# Altium schematic sheet 03_ EFR32 Signal Assignments.SchDoc: EFR32FG28 Diversity Board with discrete matching network for 868/915 MHz
size 420 x 297 mm; Doc: BRD4210C; OrgName: Silicon Labs; Page Number: 3; Page Title: EFR32 Signal Assignments; Page Size: A3; Page Count: 4; Board Designer: MSZ; RevCode: A00; DsnPath: C:\Users\maszvobo\Downloads\BRD4210A-A01-schematic-dsn\BRD4210A.DSN; SchematicName: SCHEMATIC1; PageName: 03: EFR32 Signal Assignments; PageSize: A3; TopSchematic: True
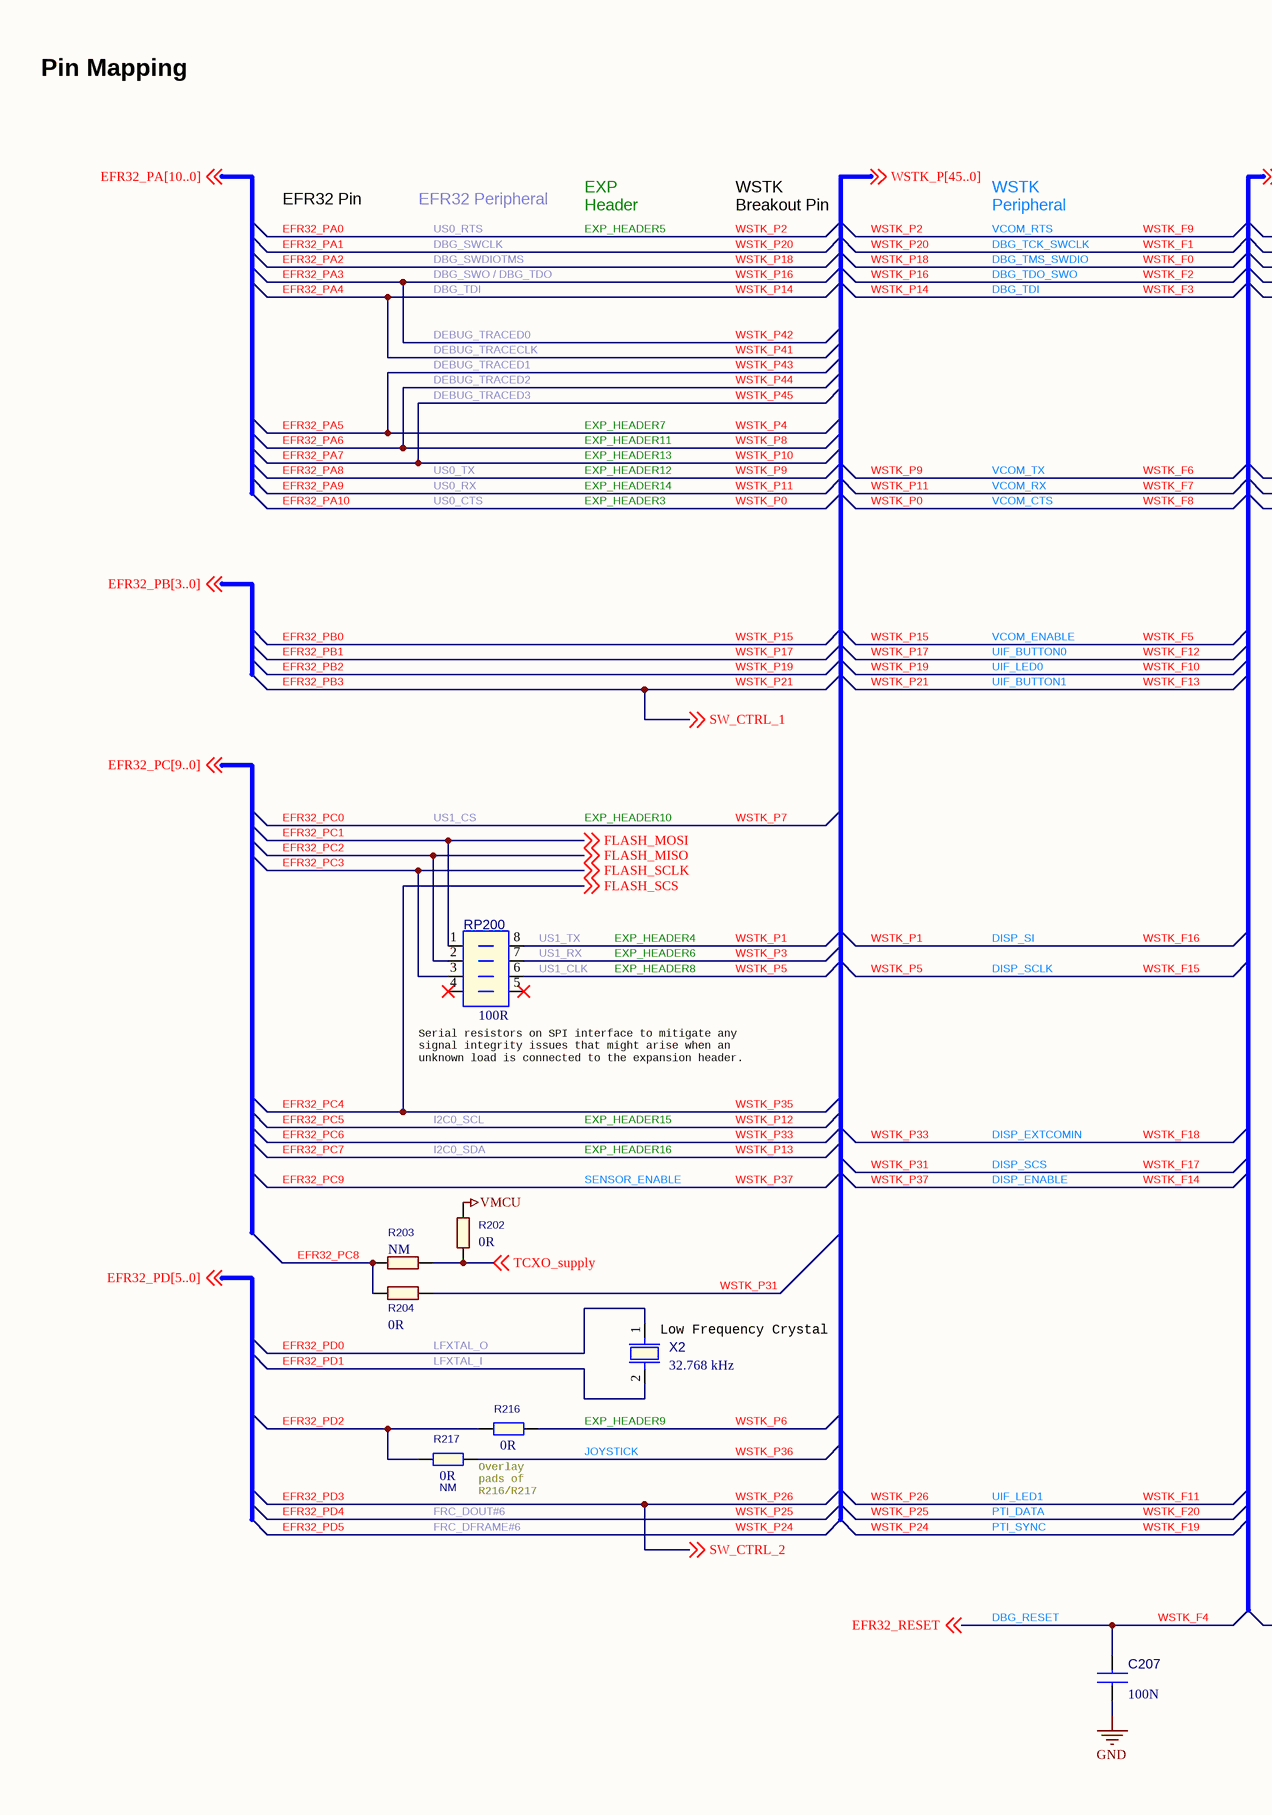
[diagram p0: 03_ EFR32 Signal Assignments.SchDoc, left]
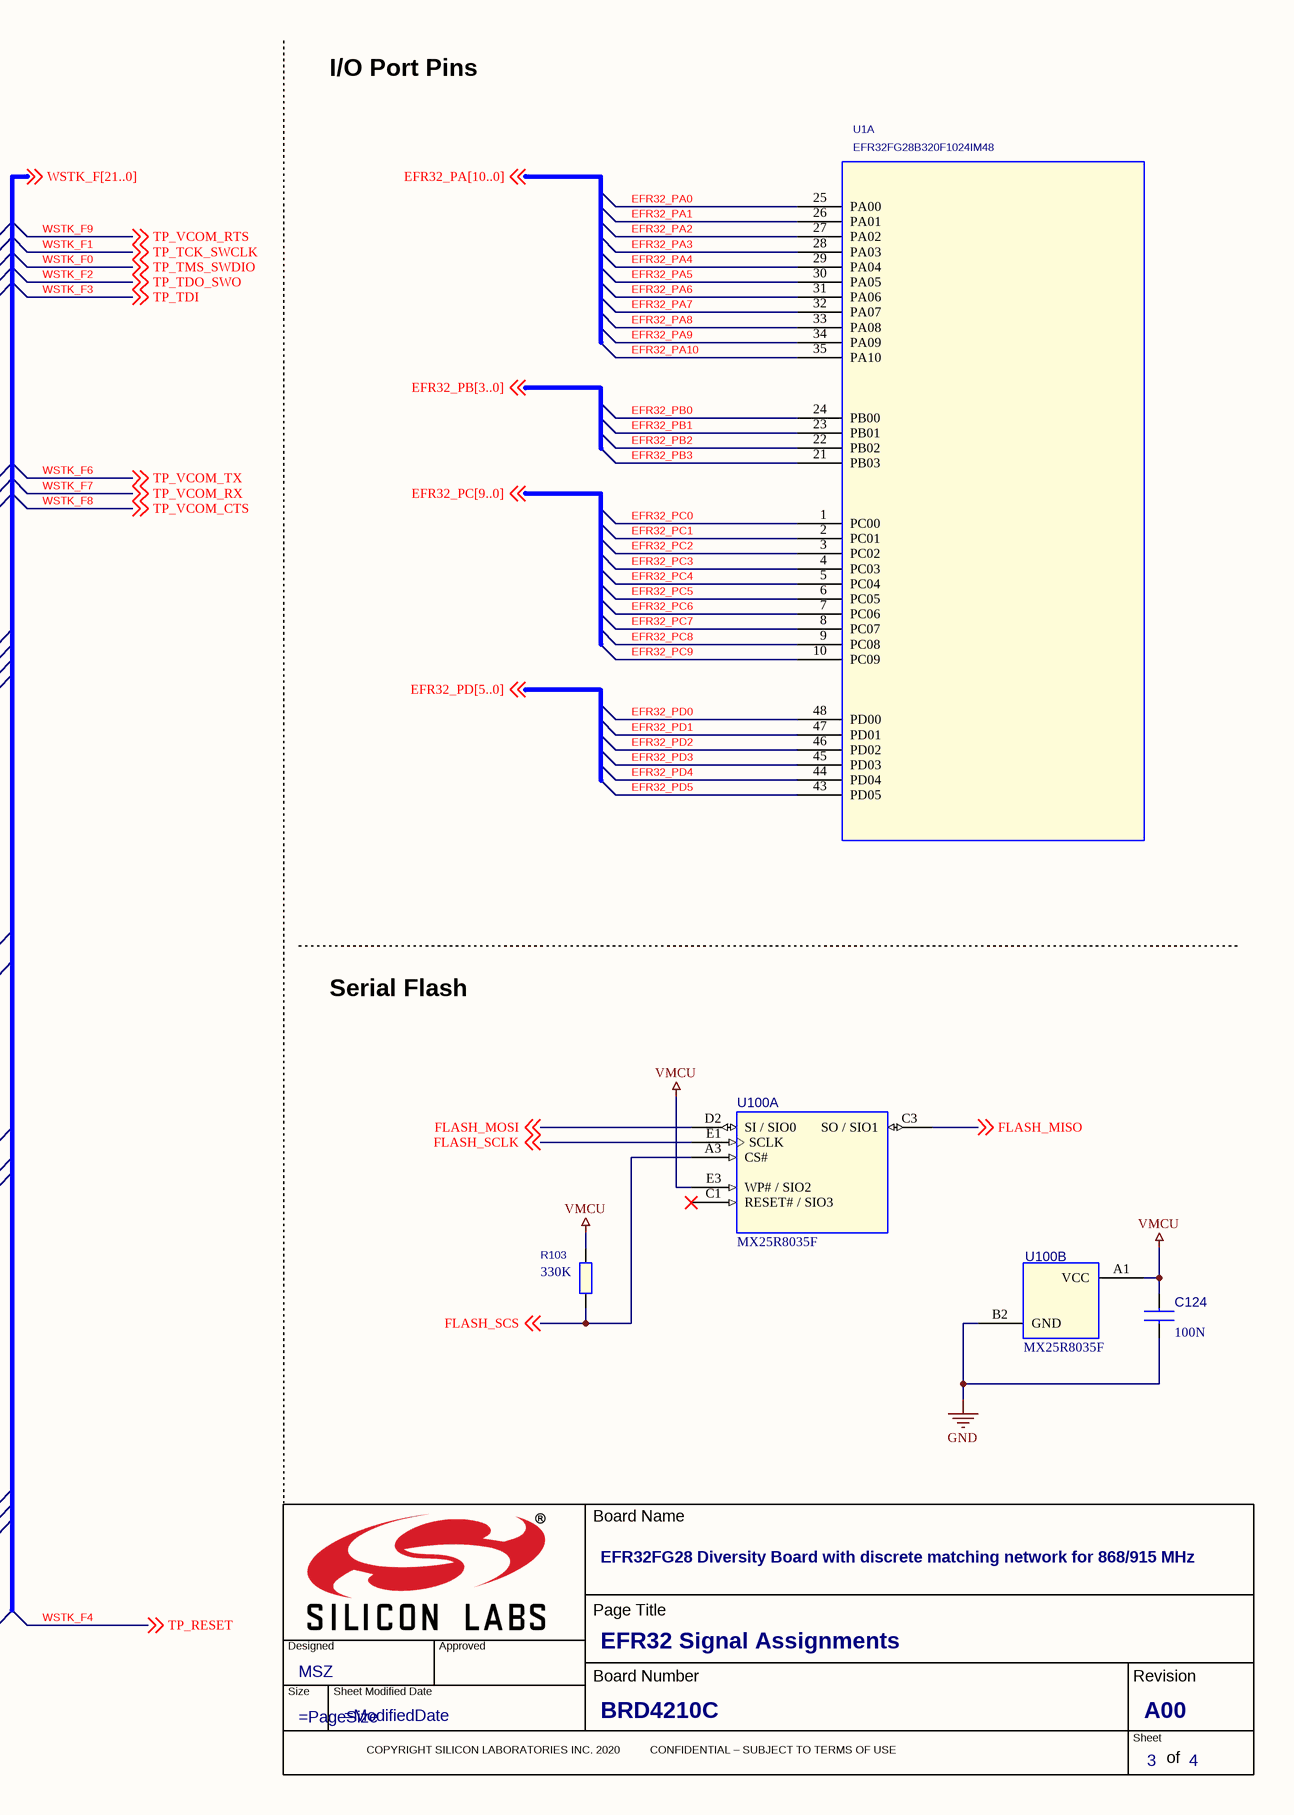
[diagram p1: 03_ EFR32 Signal Assignments.SchDoc, right]

## Parts
*  Doc: BRD4210C  RevCode: A00  Board Designer: MSZ  Page Title: EFR32 Signal Assignments  Page Number: 3  Page Count: 4  Title: EFR32FG28 Diversity Board with discrete matching network for 868/915 MHz  (graphical)
C124  100N  [C0201_L]
C207  100N  [C0201_L]
R103  330K  [R0201_L]
R202  0R  [R0201_L]
R203  NM  [R0201_L]
R204  0R  [R0201_L]
R216  0R  [R0402_L]
R217  0R  Not Mounted: NM  [R0402_L]
RP200  100R  [RES_MNR04-8]
U1  EFR32FG28B320F1024IM48  [QFN48_M040_6.0X6.0_EP_SL]  (part A of 3)
U100  MX25R8035F  [BGA8_M040_1.24x1.75_WLCSP]  (parts A,B of 2)
X2  32.768 kHz  [X_MCS_CM8V-T1A]

## Nets
GND: C124.2 C207.2 U100.B2(GND)
VMCU: C124.1 R103.2 R202.2 U100.A1(VCC) U100.E3(WP#_/_SIO2)
DBG_RESET: C207.1 ; off-sheet EFR32_RESET, off-sheet TP_RESET  [also labelled EFR32_RESET, TP_RESET, WSTK_F4]
DBG_SWCLK: U1.26(PA01) ; off-sheet TP_TCK_SWCLK  [also labelled DBG_TCK_SWCLK, EFR32_PA1, TP_TCK_SWCLK, WSTK_F1, WSTK_P20]
DBG_SWDIOTMS: U1.27(PA02) ; off-sheet TP_TMS_SWDIO  [also labelled DBG_TMS_SWDIO, EFR32_PA2, TP_TMS_SWDIO, WSTK_F0, WSTK_P18]
DBG_SWO / DBG_TDO: U1.28(PA03) ; off-sheet TP_TDO_SWO  [also labelled DBG_TDO_SWO, DEBUG_TRACED0, EFR32_PA3, TP_TDO_SWO, WSTK_F2, WSTK_P16, WSTK_P42]
DBG_TDI: U1.29(PA04) ; off-sheet TP_TDI  [also labelled DEBUG_TRACECLK, EFR32_PA4, TP_TDI, WSTK_F3, WSTK_P14, WSTK_P41]
DEBUG_TRACED1: U1.30(PA05)  [also labelled EFR32_PA5, EXP_HEADER7, WSTK_P4, WSTK_P43]
DEBUG_TRACED2: U1.31(PA06)  [also labelled EFR32_PA6, EXP_HEADER11, WSTK_P44, WSTK_P8]
DEBUG_TRACED3: U1.32(PA07)  [also labelled EFR32_PA7, EXP_HEADER13, WSTK_P10, WSTK_P45]
DISP_ENABLE: U1.10(PC09)  [also labelled EFR32_PC9, SENSOR_ENABLE, WSTK_F14, WSTK_P37]
DISP_EXTCOMIN: U1.7(PC06)  [also labelled EFR32_PC6, WSTK_F18, WSTK_P33]
DISP_SCLK: RP200.6(R16)  [also labelled EXP_HEADER8, US1_CLK, WSTK_F15, WSTK_P5]
DISP_SCS: R204.1  [also labelled WSTK_F17, WSTK_P31]
DISP_SI: RP200.8(R18)  [also labelled EXP_HEADER4, US1_TX, WSTK_F16, WSTK_P1]
EFR32_PA0: U1.25(PA00) ; off-sheet TP_VCOM_RTS  [also labelled EXP_HEADER5, TP_VCOM_RTS, US0_RTS, VCOM_RTS, WSTK_F9, WSTK_P2]
EFR32_PA8: U1.33(PA08) ; off-sheet TP_VCOM_TX  [also labelled EXP_HEADER12, TP_VCOM_TX, US0_TX, VCOM_TX, WSTK_F6, WSTK_P9]
EFR32_PA9: U1.34(PA09) ; off-sheet TP_VCOM_RX  [also labelled EXP_HEADER14, TP_VCOM_RX, US0_RX, VCOM_RX, WSTK_F7, WSTK_P11]
EFR32_PA10: U1.35(PA10) ; off-sheet TP_VCOM_CTS  [also labelled EXP_HEADER3, TP_VCOM_CTS, US0_CTS, VCOM_CTS, WSTK_F8, WSTK_P0]
EFR32_PB0: U1.24(PB00)  [also labelled VCOM_ENABLE, WSTK_F5, WSTK_P15]
EFR32_PB1: U1.23(PB01)  [also labelled UIF_BUTTON0, WSTK_F12, WSTK_P17]
EFR32_PB2: U1.22(PB02)  [also labelled UIF_LED0, WSTK_F10, WSTK_P19]
EFR32_PB3: U1.21(PB03) ; off-sheet SW_CTRL_1  [also labelled SW_CTRL_1, UIF_BUTTON1, WSTK_F13, WSTK_P21]
EFR32_PC0: U1.1(PC00)  [also labelled EXP_HEADER10, US1_CS, WSTK_P7]
EFR32_PC1: RP200.1(R11) U1.2(PC01) U100.D2(SI_/_SIO0) ; off-sheet FLASH_MOSI  [also labelled FLASH_MOSI]
EFR32_PC2: RP200.2(R12) U1.3(PC02) U100.C3(SO_/_SIO1) ; off-sheet FLASH_MISO  [also labelled FLASH_MISO]
EFR32_PC3: RP200.3(R13) U1.4(PC03) U100.E1(SCLK) ; off-sheet FLASH_SCLK  [also labelled FLASH_SCLK]
EFR32_PC4: R103.1 U1.5(PC04) U100.A3(CS#) ; off-sheet FLASH_SCS  [also labelled FLASH_SCS, WSTK_P35]
EFR32_PC5: U1.6(PC05)  [also labelled EXP_HEADER15, I2C0_SCL, WSTK_P12]
EFR32_PC7: U1.8(PC07)  [also labelled EXP_HEADER16, I2C0_SDA, WSTK_P13]
EFR32_PC8: R203.2 R204.2 U1.9(PC08)
EFR32_PD0: U1.48(PD00) X2.1  [also labelled LFXTAL_O]
EFR32_PD1: U1.47(PD01) X2.2  [also labelled LFXTAL_I]
EFR32_PD2: R216.1 R217.1 U1.46(PD02)
EFR32_PD3: U1.45(PD03) ; off-sheet SW_CTRL_2  [also labelled SW_CTRL_2, UIF_LED1, WSTK_F11, WSTK_P26]
EFR32_PD4: U1.44(PD04)  [also labelled FRC_DOUT#6, PTI_DATA, WSTK_F20, WSTK_P25]
EFR32_PD5: U1.43(PD05)  [also labelled FRC_DFRAME#6, PTI_SYNC, WSTK_F19, WSTK_P24]
EXP_HEADER6: RP200.7(R17)  [also labelled US1_RX, WSTK_P3]
EXP_HEADER9: R216.2  [also labelled WSTK_P6]
JOYSTICK: R217.2  [also labelled WSTK_P36]
TCXO_supply: R202.1 R203.1 ; off-sheet TCXO_supply

Not connected (* = marked no-connect by the designer): RP200 4(R14)* 5(R15)*; U100 C1(RESET#_/_SIO3)*

## Notes on the sheet
- Pin Mapping
- I/O Port Pins
- EFR32 Pin
- EFR32 Peripheral
- EXP Header
  Connection
- WSTK
  Breakout Pin
- WSTK Peripheral
  Connection
- Serial Flash
- (near RP200) Serial resistors on SPI interface to mitigate any
  signal integrity issues that might arise when an
  unknown load is connected to the expansion header.
- (near X2) Low Frequency Crystal
- (near R217) Overlay
  pads of
  R216/R217
- (in symbol TitleBlock_SiliconLabs_A3) Board Name; Page Title; Designed; Approved; Board Number; Revision; Size; Sheet Modified Date; Sheet; COPYRIGHT SILICON LABORATORIES INC. 2020          CONFIDENTIAL – SUBJECT TO TERMS OF USE; of

## Library data of the parts
* = TitleBlock_SiliconLabs_A3: Page Size: =PageSize; Page Modify Date: =ModifiedDate; OrgName: Silicon Labs
C124 = C0201: Part Reference: C124; Tolerance: 20%; Rating: 16V; Technology: X7S; Value: 100N; PCB Footprint: C0201_L
C207 = C0201: Part Reference: C207; Tolerance: 20%; Rating: 16V; Technology: X7S; Value: 100N; PCB Footprint: C0201_L
R103 = R0201: Part Reference: R103; Price_1K: 0.005; Value: 330K; PCB Footprint: R0201_L
R202-R204 = R0201: Price_1K: 0.005
  R202 R204: Value: 0R
  R203: Value: NM
R216 = R0402: Part Reference: R216; Price_1K: 0.005; Value: 0R; PCB Footprint: R0402_L
R217 = R0402: Part Reference: R217; Price_1K: 0.005; Value: 0R; PCB Footprint: R0402_L
RP200 = MNR04M0APJ101: Part Reference: RP200; Mfg: ROHM; Price_1K: 0.0122; Mfg #: MNR04M0APJ101; Value: 100R; PCB Footprint: RES_MNR04-8
U1 = EFR32xG23_QFN48: Part Reference: U1; MFG: Silicon Labs; MFG #: EFR32ZG23B020F512IM48-CR; Value: EFR32FG28B320F1024IM48; PCB Footprint: QFN48_M040_6.0X6.0_EP_SL
U100 = MX25R8035: Part Reference: U100; Mfg: Macronix; Mfg #: MX25R8035FBDIL0; Price_1K: 0.25; Value: MX25R8035F; PCB Footprint: BGA8_M040_1.24x1.75_WLCSP
X2 = CM8V-T1A: Part Reference: X2; Mfg: Micro Crystal AG; Mfg #: CM8V-T1A-32.768KHZ-7PF-20PPM-TA-QC; Price_1K: 0.3; Value: 32.768 kHz; PCB Footprint: X_MCS_CM8V-T1A